# Altium schematic sheet MCU.SchDoc
size A3; SheetNumber: 5; SheetTotal: 5
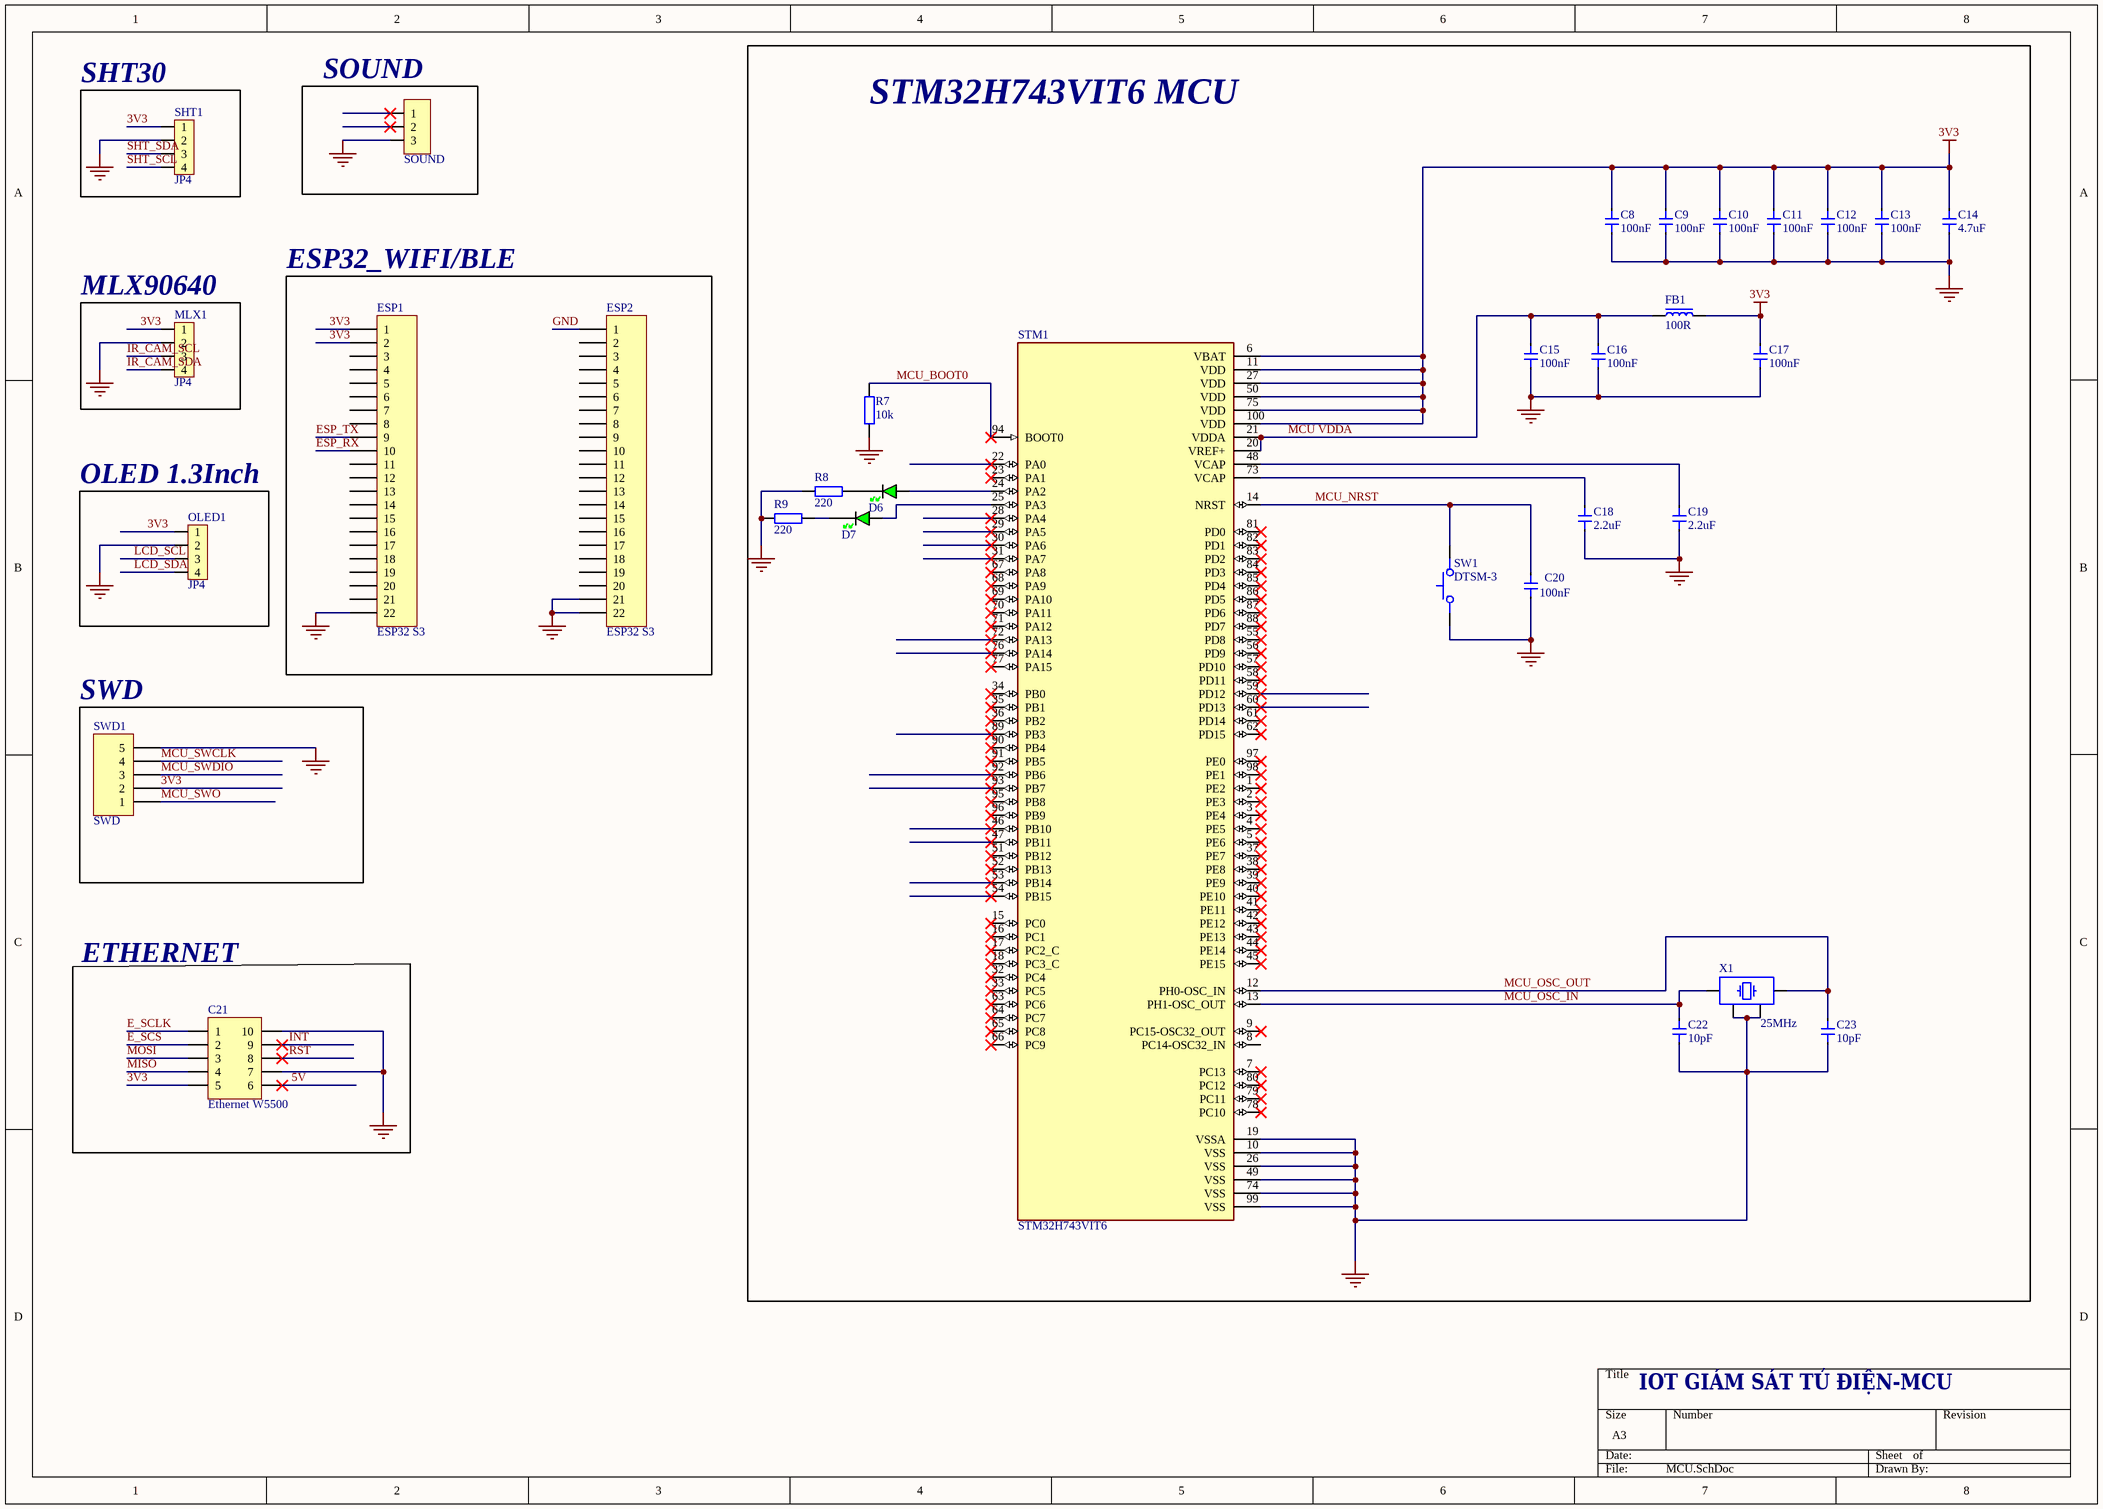
[diagram p0: MCU.SchDoc]

## Parts
C8  100nF  [Cap 0805]
C9  100nF  [Cap 0805]
C10  100nF  [Cap 0805]
C11  100nF  [Cap 0805]
C12  100nF  [Cap 0805]
C13  100nF  [Cap 0805]
C14  4.7uF  [Cap 0805]
C15  100nF  [Cap 0805]
C16  100nF  [Cap 0805]
C17  100nF  [Cap 0805]
C18  2.2uF  [Cap 0805]
C19  2.2uF  [Cap 0805]
C20  100nF  [Cap 0805]
C21  Ethernet W5500  [JP5-D2T]
C22  10pF  [Cap 0805]
C23  10pF  [Cap 0805]
D6  GREEN  [LED_0805_GREEN]  (value not drawn)
D7  GREEN  [LED_0805_GREEN]  (value not drawn)
ESP1  ESP32 S3  [HDR1X22]
ESP2  ESP32 S3  [HDR1X22]
FB1  100R  [FB_0805]
JP1  SOUND  [JP 1x3 CT]
MLX1  JP4  [JP4-C1T]
OLED1  JP4  [JP4-C1T]
R7  10k  [RES_0805]
R8  220  [RES_0805]
R9  220  [RES_0805]
SHT1  JP4  [JP4-C1T]
STM1  STM32H743VIT6  [QFP50P1600X1600X160-100N]
SW1  DTSM-3  [DTSM-3]
SWD1  SWD  [HDR1X5]
X1  25MHz  [XTAL_3225]

## Blocks framed on the sheet
STM32H743VIT6 MCU: C8-C20 C22 C23 D6 D7 FB1 R7-R9 STM1 SW1 X1
SHT30: SHT1
SOUND: JP1
ESP32_WIFI/BLE: ESP1 ESP2
MLX90640: MLX1
OLED 1.3Inch: OLED1
SWD: SWD1
ETHERNET: C21

## Nets
3V3: C8.1 C9.1 C10.1 C11.1 C12.1 C13.1 C14.1 C17.1 C21.5 ESP1.1 ESP1.2 FB1.2 MLX1.1 OLED1.1 SHT1.1 STM1.6(VBAT) STM1.11(VDD) STM1.27(VDD) STM1.50(VDD) STM1.75(VDD) STM1.100(VDD) SWD1.2
GND: C8.2 C9.2 C10.2 C11.2 C12.2 C13.2 C14.2 C15.2 C16.2 C17.2 C18.1 C19.2 C20.2 C21.7 C21.10 C22.2 C23.2 ESP1.22 ESP2.1 ESP2.21 ESP2.22 JP1.3 MLX1.2 OLED1.2 R7.1 R8.1 R9.1 SHT1.2 STM1.10(VSS) STM1.19(VSSA) STM1.26(VSS) STM1.49(VSS) STM1.74(VSS) STM1.99(VSS) SW1.1 SWD1.5 X1.2 X1.4
5V: C21.6
E_SCLK: C21.1
E_SCS: C21.2
ESP_RX: ESP1.10
ESP_TX: ESP1.9
INT: C21.9
IR_CAM_SCL: MLX1.3
IR_CAM_SDA: MLX1.4
LCD_SCL: OLED1.3
LCD_SDA: OLED1.4
MCU VDDA: C15.1 C16.1 FB1.1 STM1.20(VREF+) STM1.21(VDDA)
MCU_BOOT0: R7.2 STM1.94(BOOT0)
MCU_NRST: C20.1 STM1.14(NRST) SW1.2
MCU_OSC_IN: C22.1 STM1.13(PH1-OSC_OUT) X1.1
MCU_OSC_OUT: C23.1 STM1.12(PH0-OSC_IN) X1.3
MCU_SWCLK: SWD1.4
MCU_SWDIO: SWD1.3
MCU_SWO: SWD1.1
MISO: C21.4
MOSI: C21.3
RST: C21.8
SHT_SCL: SHT1.4
SHT_SDA: SHT1.3
NetC18_2: C18.2 STM1.73(VCAP)
NetC19_1: C19.1 STM1.48(VCAP)
NetD6_A: D6.A STM1.24(PA2)
NetD6_K: D6.K R8.2
NetD7_A: D7.A STM1.25(PA3)
NetD7_K: D7.K R9.2

Not connected (* = marked no-connect by the designer): ESP1 3 4 5 6 7 8 11 12 13 14 15 16 17 18 19 20 21; ESP2 2 3 4 5 6 7 8 9 10 11 12 13 14 15 16 17 18 19 20; JP1 1* 2*; STM1 1(PE2)* 2(PE3)* 3(PE4)* 4(PE5)* 5(PE6)* 7(PC13)* 8(PC14-OSC32_IN) 9(PC15-OSC32_OUT)* 15(PC0)* 16(PC1)* 17(PC2_C)* 18(PC3_C)* 22(PA0)* 23(PA1)* 28(PA4)* 29(PA5)* 30(PA6)* 31(PA7)* 32(PC4)* 33(PC5)* 34(PB0)* 35(PB1)* 36(PB2)* 37(PE7)* 38(PE8)* 39(PE9)* 40(PE10)* 41(PE11)* 42(PE12)* 43(PE13)* 44(PE14)* 45(PE15)* 46(PB10)* 47(PB11)* 51(PB12)* 52(PB13)* 53(PB14)* 54(PB15)* 55(PD8)* 56(PD9)* 57(PD10)* 58(PD11)* 59(PD12)* 60(PD13)* 61(PD14)* 62(PD15)* 63(PC6)* 64(PC7)* 65(PC8)* 66(PC9)* 67(PA8)* 68(PA9)* 69(PA10)* 70(PA11)* 71(PA12)* 72(PA13)* 76(PA14)* 77(PA15)* 78(PC10)* 79(PC11)* 80(PC12)* 81(PD0)* 82(PD1)* 83(PD2)* 84(PD3)* 85(PD4)* 86(PD5)* 87(PD6)* 88(PD7)* 89(PB3)* 90(PB4)* 91(PB5)* 92(PB6)* 93(PB7)* 95(PB8)* 96(PB9)* 97(PE0)* 98(PE1)*

## Notes on the sheet
- IOT GIÁM SÁT TỦ ĐIỆN-MCU

## Library data of the parts
C8-C20 C22 C23 = Cap 0805: Capacitor SMD 0805
C21 = JP5x2: WR-PHD 2.54 mm Dual Socket Header; Manufacturer: W¨¹rth Elektronik eiSos GmbH; partNo: 61301021821; ComponentLink1 Description: Manufacturer; ComponentLink2 Description: Datasheet; NoPins: 10; Created Date: 29 March 2013; ComponentLink1URL: http://www.we-online.com; ComponentLink2URL: http://katalog.we-online.de/em/datasheet/6130xx21821.pdf; Created by: Karrer Zheng
D6 D7 = LED_0805_GREEN: LED 0805 GREEN SMD; Manufacturer: *; Manufacturer Part Number: *; Distributor Link: *; LCSC: *
ESP1 ESP2 = Header 22: Header, 22-Pin; LatestRevisionDate: 17-Jul-2002; LatestRevisionNote: Re-released for DXP Platform.; Publisher: Altium Limited
FB1 = FB_0805: Ferrite Bead SMD 0805; Manufacturer: *; Manufacturer Part Number: *; Distributor Link: *; LCSC: *
JP1 = JP 1x3 2.54 Cai Thang: Cắm; Ten_Linh_Kien: Jump Đơn Cái 2.54MM 1x20P Thẳng; Don_Vi: Con; Ma_Hang: MH004006; Ghi_Chu: *; Kieu_Chan: *; Chung_Loai: Cắm
MLX1 OLED1 SHT1 = JP4: WR-PHD 2.54 mm Angled Socket Header; Manufacturer: W¨¹rth Elektronik eiSos GmbH; partNo: 613004143121; ComponentLink1 Description: Manufacturer; ComponentLink2 Description: Datasheet; NoPins: 04; Created Date: 29 March 2013; ComponentLink1URL: http://www.we-online.com; ComponentLink2URL: http://katalog.we-online.de/em/datasheet/6130xx143121.pdf; Created by: Karrer Zheng
R7-R9 = RES_0805: Resistor SMD 0805; Manufacturer: *; Manufacturer Part Number: *; Distributor Link: *; LCSC: *
STM1 = STM32H743VIT6: ARMÂ® CortexÂ®-M7 STM32H7 Microcontroller IC 32-Bit Single-Core 480MHz 2MB (2M x 8) FLASH 100-LQFP (14x14); MF: STMicroelectronics; SnapEDA_Link: https://www.snapeda.com/parts/STM32H743VIT6/STMicroelectronics/view-part/?ref=snap; Package: LQFP-100 STMicroelectronics; Value: *; MP: STM32H743VIT6; Check_prices: https://www.snapeda.com/parts/STM32H743VIT6/STMicroelectronics/view-part/?ref=eda
SW1 = DTSM-3: Tactile Switch SMD SPST; Manufacturer: Diptronics; Manufacturer Part Number: DTSM-3
SWD1 = Header 5: Header, 5-Pin; LatestRevisionDate: 17-Jul-2002; LatestRevisionNote: Re-released for DXP Platform.; Publisher: Altium Limited
X1 = TSX-3225_24.0000MF15X-AC: Crystal SMD 24MHz 10PPM 7pF 3225; Manufacturer: Epson; Manufacturer Part Number: TSX-3225 24.0000MF15X-AC